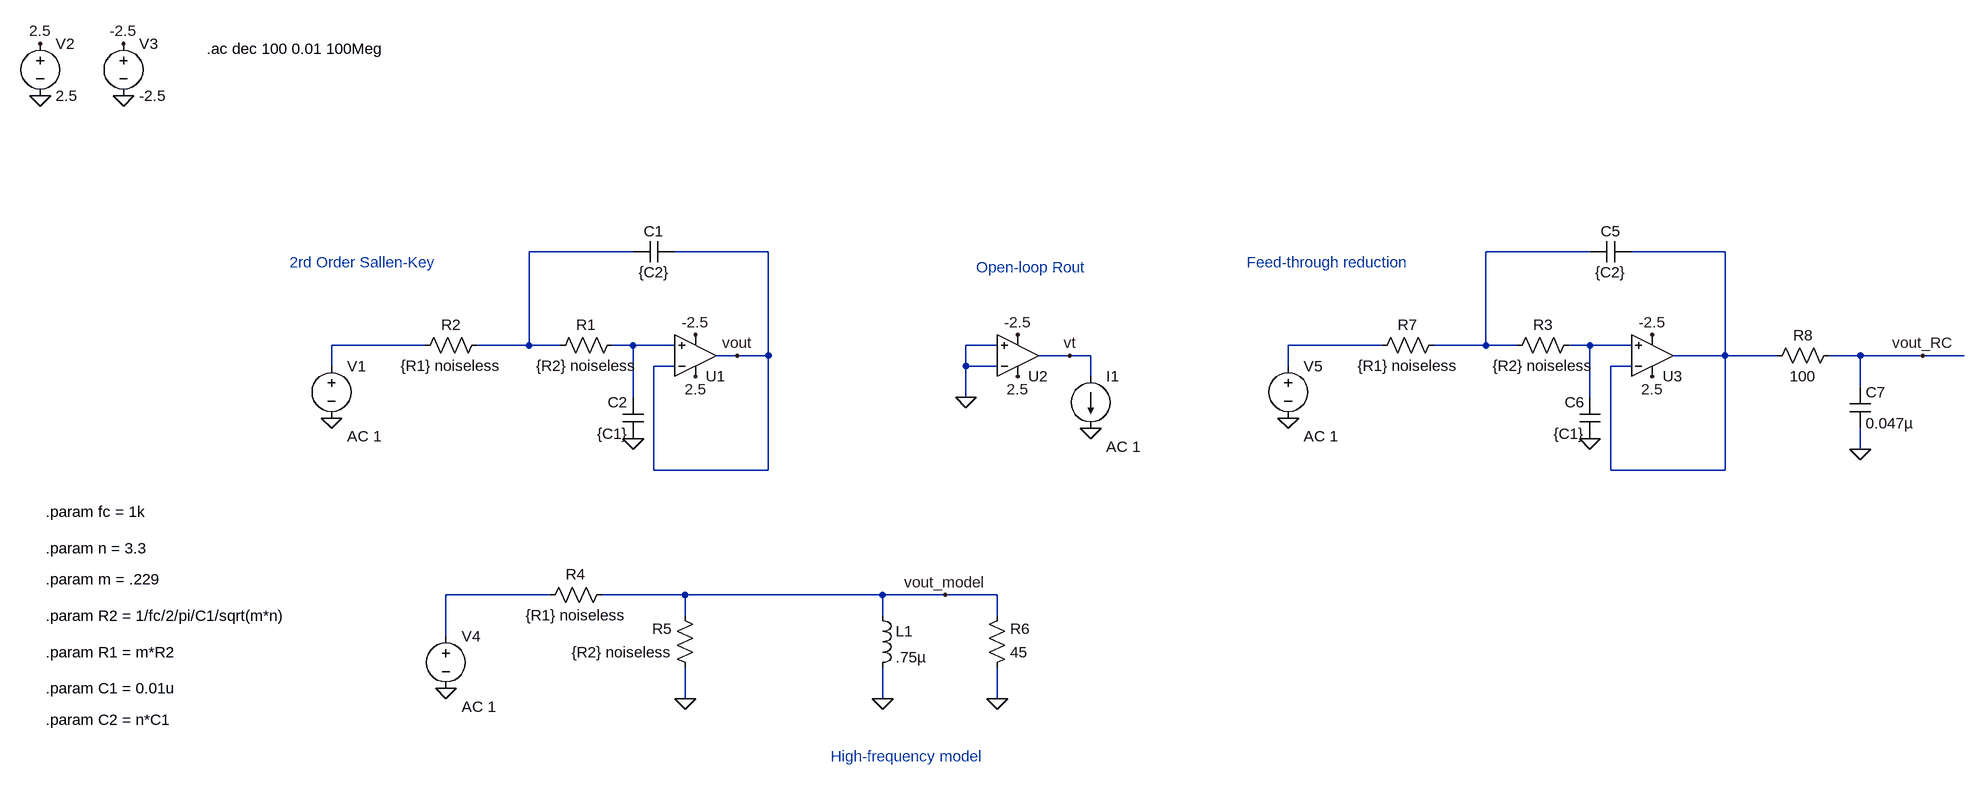
[diagram p0: schematic sallen_key_high_frequency.asc]
sallen_key_high_frequency.asc, the LTspice schematic file:
Version 4
SHEET 1 2516 856
WIRE 464 0 304 0
WIRE 672 0 528 0
WIRE 1936 0 1776 0
WIRE 2144 0 2000 0
WIRE 144 144 0 144
WIRE 304 144 304 0
WIRE 304 144 224 144
WIRE 352 144 304 144
WIRE 464 144 432 144
WIRE 528 144 464 144
WIRE 1024 144 976 144
WIRE 1616 144 1472 144
WIRE 1776 144 1776 0
WIRE 1776 144 1696 144
WIRE 1824 144 1776 144
WIRE 1936 144 1904 144
WIRE 2000 144 1936 144
WIRE 624 160 592 160
WIRE 672 160 672 0
WIRE 672 160 624 160
WIRE 1136 160 1088 160
WIRE 1168 160 1136 160
WIRE 2144 160 2144 0
WIRE 2144 160 2064 160
WIRE 2224 160 2144 160
WIRE 2352 160 2304 160
WIRE 2448 160 2352 160
WIRE 2512 160 2448 160
WIRE 0 176 0 144
WIRE 528 176 496 176
WIRE 976 176 976 144
WIRE 1024 176 976 176
WIRE 1472 176 1472 144
WIRE 2000 176 1968 176
WIRE 1168 192 1168 160
WIRE 2352 208 2352 160
WIRE 464 224 464 144
WIRE 976 224 976 176
WIRE 1936 224 1936 144
WIRE 2352 304 2352 272
WIRE 496 336 496 176
WIRE 672 336 672 160
WIRE 672 336 496 336
WIRE 1968 336 1968 176
WIRE 2144 336 2144 160
WIRE 2144 336 1968 336
WIRE 336 528 176 528
WIRE 544 528 416 528
WIRE 848 528 544 528
WIRE 944 528 848 528
WIRE 1024 528 944 528
WIRE 544 560 544 528
WIRE 848 560 848 528
WIRE 1024 560 1024 528
WIRE 176 592 176 528
WIRE 544 688 544 640
WIRE 848 688 848 640
WIRE 1024 688 1024 640
FLAG 560 192 2.5
FLAG 560 128 -2.5
FLAG 464 288 0
FLAG 0 256 0
FLAG -448 -320 2.5
FLAG -320 -320 -2.5
FLAG -448 -240 0
FLAG -320 -240 0
FLAG 624 160 vout
FLAG 848 688 0
FLAG 176 672 0
FLAG 944 528 vout_model
FLAG 544 688 0
FLAG 1024 688 0
FLAG 1056 192 2.5
FLAG 1056 128 -2.5
FLAG 976 224 0
FLAG 1168 272 0
FLAG 1136 160 vt
FLAG 2032 192 2.5
FLAG 2032 128 -2.5
FLAG 1936 288 0
FLAG 1472 256 0
FLAG 2352 304 0
FLAG 2448 160 vout_RC
SYMBOL Opamps\\UniversalOpamp2 560 160 M180
SYMATTR InstName U1
SYMATTR Value2 Avol=1Meg GBW=1Meg Slew=10Meg
SYMBOL res 448 128 R90
WINDOW 0 0 56 VBottom 2
WINDOW 3 32 56 VTop 2
SYMATTR InstName R1
SYMATTR Value {R2} noiseless
SYMBOL res 240 128 R90
WINDOW 0 0 56 VBottom 2
WINDOW 3 32 56 VTop 2
SYMATTR InstName R2
SYMATTR Value {R1} noiseless
SYMBOL cap 528 -16 R90
WINDOW 0 0 32 VBottom 2
WINDOW 3 32 32 VTop 2
SYMATTR InstName C1
SYMATTR Value {C2}
SYMBOL cap 480 288 R180
WINDOW 0 24 56 Left 2
WINDOW 3 24 8 Left 2
SYMATTR InstName C2
SYMATTR Value {C1}
SYMBOL voltage 0 160 R0
WINDOW 123 24 124 Left 2
WINDOW 39 0 0 Left 0
WINDOW 3 24 44 Left 2
SYMATTR Value2 AC 1
SYMATTR Value ""
SYMATTR InstName V1
SYMBOL voltage -448 -336 R0
WINDOW 123 0 0 Left 0
WINDOW 39 0 0 Left 0
SYMATTR InstName V2
SYMATTR Value 2.5
SYMBOL voltage -320 -336 R0
WINDOW 123 0 0 Left 0
WINDOW 39 0 0 Left 0
SYMATTR InstName V3
SYMATTR Value -2.5
SYMBOL res 432 512 R90
WINDOW 0 0 56 VBottom 2
WINDOW 3 32 56 VTop 2
SYMATTR InstName R4
SYMATTR Value {R1} noiseless
SYMBOL res 560 656 R180
WINDOW 0 36 76 Left 2
WINDOW 3 36 40 Left 2
SYMATTR InstName R5
SYMATTR Value {R2} noiseless
SYMBOL ind 832 544 R0
SYMATTR InstName L1
SYMATTR Value .75µ
SYMBOL voltage 176 576 R0
WINDOW 123 24 124 Left 2
WINDOW 39 0 0 Left 0
WINDOW 3 24 44 Left 2
SYMATTR Value2 AC 1
SYMATTR Value ""
SYMATTR InstName V4
SYMBOL res 1008 656 M180
WINDOW 0 36 76 Left 2
WINDOW 3 36 40 Left 2
SYMATTR InstName R6
SYMATTR Value 45
SYMBOL Opamps\\UniversalOpamp2 1056 160 M180
SYMATTR InstName U2
SYMATTR Value2 Avol=1Meg GBW=1Meg Slew=10Meg
SYMBOL current 1168 192 R0
WINDOW 123 24 108 Left 2
WINDOW 39 0 0 Left 0
SYMATTR Value2 AC 1
SYMATTR InstName I1
SYMATTR Value ""
SYMBOL Opamps\\UniversalOpamp2 2032 160 M180
SYMATTR InstName U3
SYMATTR Value2 Avol=1Meg GBW=1Meg Slew=10Meg
SYMBOL res 1920 128 R90
WINDOW 0 0 56 VBottom 2
WINDOW 3 32 56 VTop 2
SYMATTR InstName R3
SYMATTR Value {R2} noiseless
SYMBOL res 1712 128 R90
WINDOW 0 0 56 VBottom 2
WINDOW 3 32 56 VTop 2
SYMATTR InstName R7
SYMATTR Value {R1} noiseless
SYMBOL cap 2000 -16 R90
WINDOW 0 0 32 VBottom 2
WINDOW 3 32 32 VTop 2
SYMATTR InstName C5
SYMATTR Value {C2}
SYMBOL cap 1952 288 R180
WINDOW 0 24 56 Left 2
WINDOW 3 24 8 Left 2
SYMATTR InstName C6
SYMATTR Value {C1}
SYMBOL voltage 1472 160 R0
WINDOW 123 24 124 Left 2
WINDOW 39 0 0 Left 0
WINDOW 3 24 44 Left 2
SYMATTR Value2 AC 1
SYMATTR Value ""
SYMATTR InstName V5
SYMBOL res 2320 144 R90
WINDOW 0 0 56 VBottom 2
WINDOW 3 32 56 VTop 2
SYMATTR InstName R8
SYMATTR Value 100
SYMBOL cap 2336 208 R0
SYMATTR InstName C7
SYMATTR Value 0.047µ
TEXT -64 16 Left 2 ;2rd Order Sallen-Key
TEXT -440 400 Left 2 !.param fc = 1k
TEXT -192 -312 Left 2 !.ac dec 100 0.01 100Meg
TEXT -440 560 Left 2 !.param R2 = 1/fc/2/pi/C1/sqrt(m*n)
TEXT -440 672 Left 2 !.param C1 = 0.01u
TEXT -440 456 Left 2 !.param n = 3.3
TEXT -440 504 Left 2 !.param m = .229
TEXT -440 720 Left 2 !.param C2 = n*C1
TEXT -440 616 Left 2 !.param R1 = m*R2
TEXT 992 24 Left 2 ;Open-loop Rout
TEXT 768 776 Left 2 ;High-frequency model
TEXT 1408 16 Left 2 ;Feed-through reduction

The netlist it stands for:
* sallen_key_high_frequency.asc
XU1 N005 vout 2.5 -2.5 vout level.2 Avol=1Meg GBW=1Meg Slew=10Meg ilimit=25m rail=0 Vos=0 phimargin=45 en=0 enk=0 in=0 ink=0 Rin=500Meg  ; pins IN+ IN- V+ V- OUT
R1 N005 N001 {R2} noiseless
R2 N001 N004 {R1} noiseless
C1 vout N001 {C2}
C2 0 N005 {C1}
V1 N004 0 AC 1
V2 2.5 0 2.5
V3 -2.5 0 -2.5
R4 vout_model N008 {R1} noiseless
R5 0 vout_model {R2} noiseless
L1 vout_model 0 .75µ
V4 N008 0 AC 1
R6 0 vout_model 45
XU2 0 0 2.5 -2.5 vt level.2 Avol=1Meg GBW=1Meg Slew=10Meg ilimit=25m rail=0 Vos=0 phimargin=45 en=0 enk=0 in=0 ink=0 Rin=500Meg  ; pins IN+ IN- V+ V- OUT
I1 vt 0 AC 1
XU3 N007 N003 2.5 -2.5 N003 level.2 Avol=1Meg GBW=1Meg Slew=10Meg ilimit=25m rail=0 Vos=0 phimargin=45 en=0 enk=0 in=0 ink=0 Rin=500Meg  ; pins IN+ IN- V+ V- OUT
R3 N007 N002 {R2} noiseless
R7 N002 N006 {R1} noiseless
C5 N003 N002 {C2}
C6 0 N007 {C1}
V5 N006 0 AC 1
R8 vout_RC N003 100
C7 vout_RC 0 0.047µ
* 2rd Order Sallen-Key
.param fc = 1k
.ac dec 100 0.01 100Meg
.param R2 = 1/fc/2/pi/C1/sqrt(m*n)
.param C1 = 0.01u
.param n = 3.3
.param m = .229
.param C2 = n*C1
.param R1 = m*R2
* Open-loop Rout
* High-frequency model
* Feed-through reduction
.lib UniversalOpamps2.sub
.backanno
.end